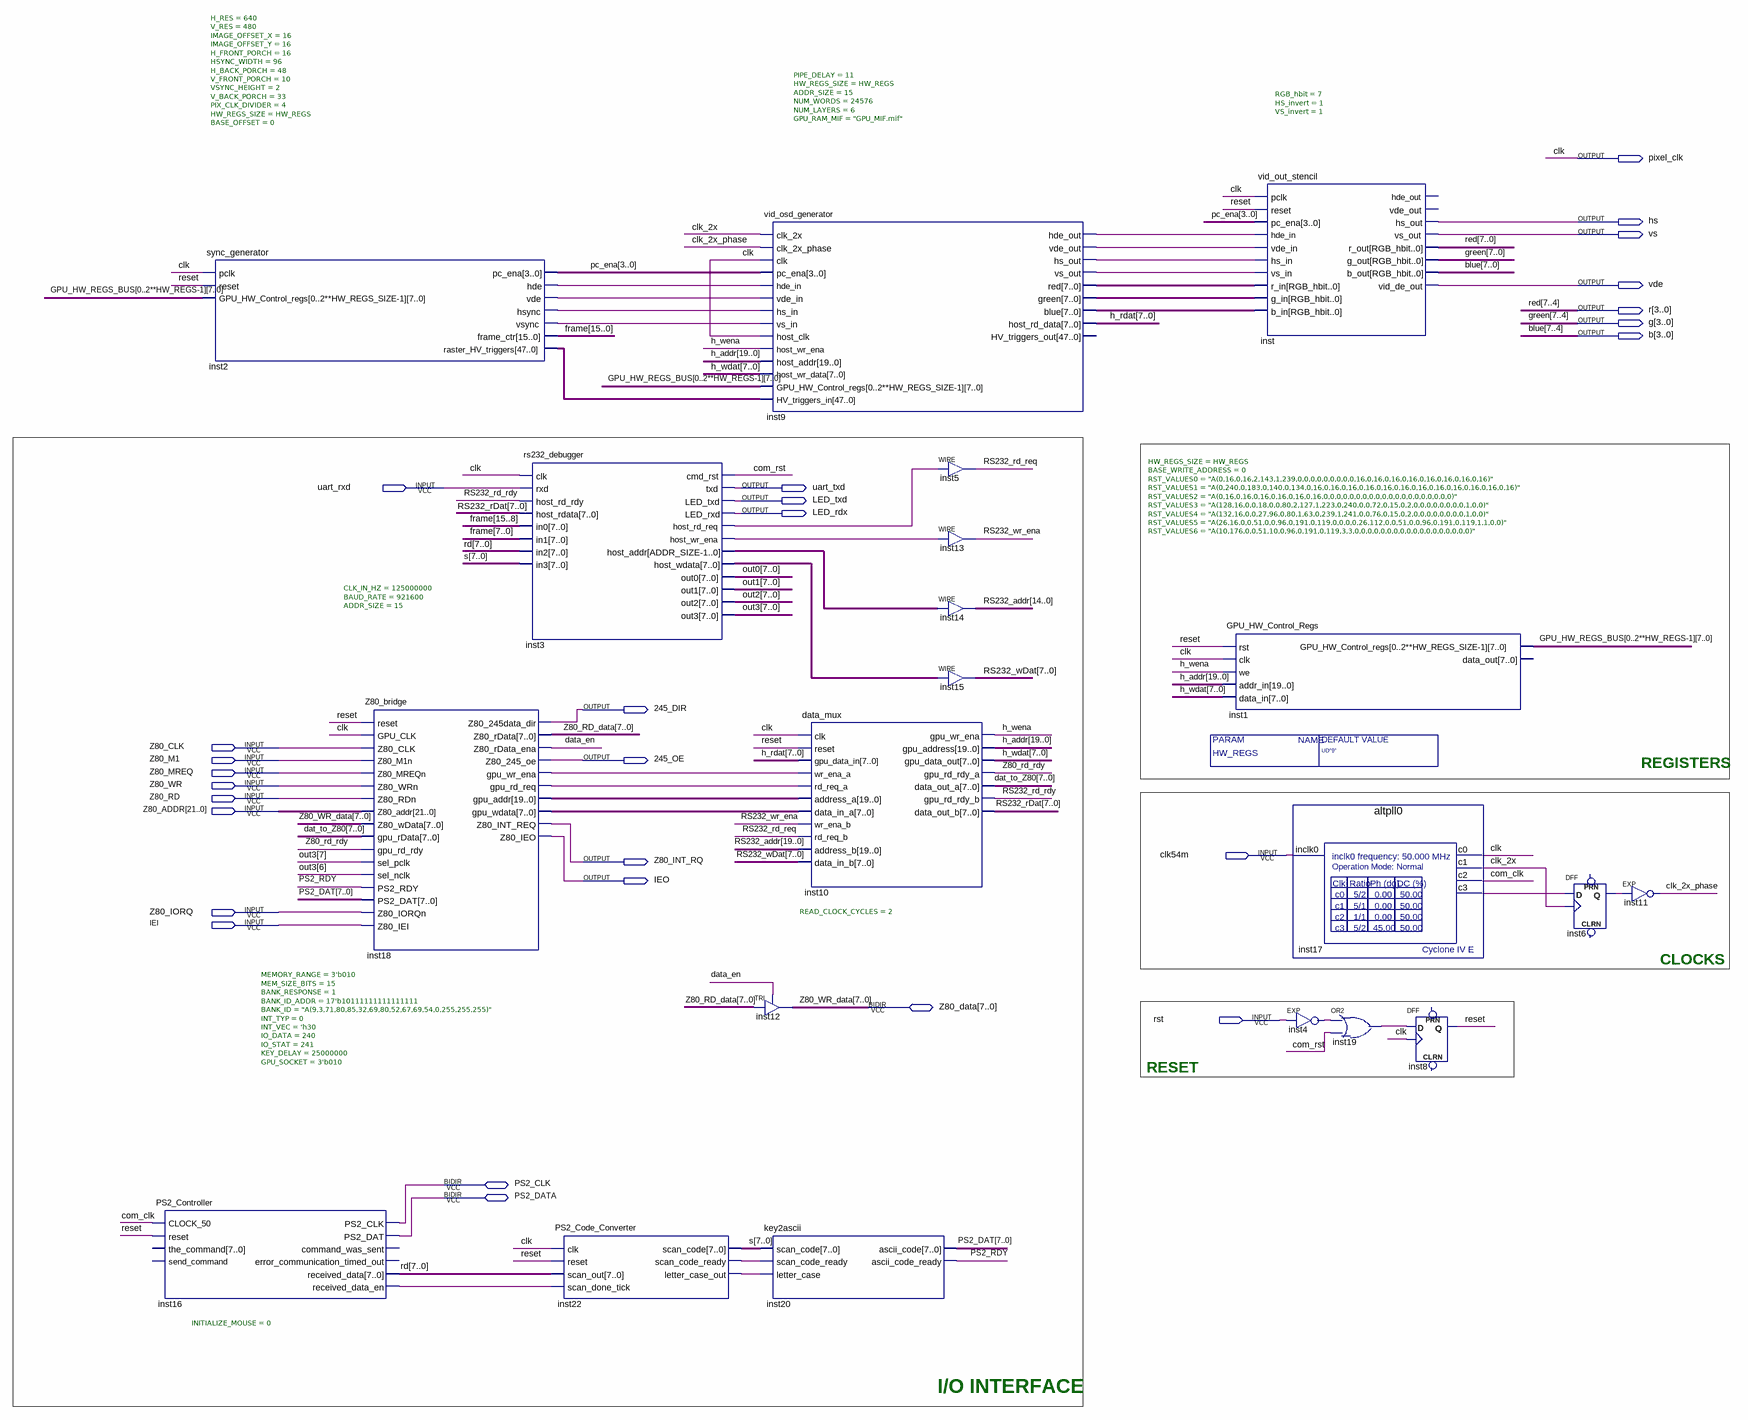
[diagram p0: schematic sheet]
// Quartus schematic GPU.bdf as structural Verilog: 21 symbols, 28 pins
module GPU #(parameter HW_REGS = "UD\"9\"") (
  input  uart_rxd,
  input  Z80_CLK,
  input  Z80_M1,
  input  Z80_MREQ,
  input  Z80_WR,
  input  Z80_RD,
  input  [21:0] Z80_ADDR,
  input  clk54m,
  input  Z80_IORQ,
  input  IEI,
  input  rst,
  inout  [7:0] Z80_data,
  inout  PS2_CLK,
  inout  PS2_DATA,
  output pixel_clk,
  output hs,
  output vs,
  output vde,
  output [3:0] r,
  output [3:0] g,
  output [3:0] b,
  output uart_txd,
  output LED_txd,
  output LED_rdx,
  output \245_DIR ,
  output \245_OE ,
  output Z80_INT_RQ,
  output IEO
);

  wire clk_2x, clk_2x_phase, com_clk, com_rst, data_en, h_wena, inst2_hde, inst2_hsync, inst2_vde,
       inst2_vsync, inst3_host_rd_req, inst3_host_wr_ena, inst4_out, inst6_q, inst9_hde_out, inst9_hs_out,
       inst9_vde_out, inst9_vs_out, inst16_received_data_en, inst17_c3, inst18_gpu_rd_req, inst18_gpu_wr_ena,
       inst19_out, inst22_letter_case_out, inst22_scan_code_ready, PS2_RDY, reset, RS232_rd_rdy,
       RS232_rd_req, RS232_wr_ena, Z80_rd_rdy;
  wire [3:0] blue, green, pc_ena, red;
  wire [7:0] dat_to_Z80, \GPU_HW_REGS_BUS[0..2**HW_REGS-1] , h_rdat, h_wdat, inst3_host_wdata, inst9_blue,
       inst9_green, inst9_red, inst18_gpu_wdata, out0, out1, out2, out3, PS2_DAT, rd, RS232_rDat, RS232_wDat,
       s, Z80_RD_data;
  wire [14:0] inst3_host_addr;
  wire [15:0] frame;
  wire [19:0] h_addr, inst18_gpu_addr, RS232_addr;
  wire [47:0] inst2_raster_hv_triggers;

  PS2_Controller #(.INITIALIZE_MOUSE(0)) inst16 (
    .CLOCK_50(com_clk), .reset(reset), .received_data(rd), .received_data_en(inst16_received_data_en),
    .PS2_CLK(PS2_CLK), .PS2_DAT(PS2_DATA));  // open: the_command, send_command, command_was_sent, error_communication_timed_out
  sync_generator #(.H_RES(640), .V_RES(480), .IMAGE_OFFSET_X(16), .IMAGE_OFFSET_Y(16), .H_FRONT_PORCH(16), .HSYNC_WIDTH(96), .H_BACK_PORCH(48), .V_FRONT_PORCH(10), .VSYNC_HEIGHT(2), .V_BACK_PORCH(33), .PIX_CLK_DIVIDER(4), .HW_REGS_SIZE(HW_REGS), .BASE_OFFSET(0)) inst2 (
    .pclk(pixel_clk), .reset(reset), .GPU_HW_Control_regs(\GPU_HW_REGS_BUS[0..2**HW_REGS-1] ),
    .pc_ena(pc_ena), .hde(inst2_hde), .vde(inst2_vde), .hsync(inst2_hsync), .vsync(inst2_vsync),
    .frame_ctr(frame), .raster_HV_triggers(inst2_raster_hv_triggers));
  Z80_bridge #(.MEMORY_RANGE(3'b010), .MEM_SIZE_BITS(15), .BANK_RESPONSE(1), .BANK_ID_ADDR(17'b10111111111111111), .BANK_ID("A(9,3,71,80,85,32,69,80,52,67,69,54,0,255,255,255)"), .INT_TYP(0), .INT_VEC('h30), .IO_DATA(240), .IO_STAT(241), .KEY_DELAY(25000000), .GPU_SOCKET(3'b010)) inst18 (
    .reset(reset), .GPU_CLK(pixel_clk), .Z80_CLK(Z80_CLK), .Z80_M1n(Z80_M1), .Z80_MREQn(Z80_MREQ),
    .Z80_WRn(Z80_WR), .Z80_RDn(Z80_RD), .Z80_addr(Z80_ADDR), .Z80_wData(Z80_data), .gpu_rData(dat_to_Z80),
    .gpu_rd_rdy(Z80_rd_rdy), .sel_pclk(out3[7]), .sel_nclk(out3[6]), .PS2_RDY(PS2_RDY), .PS2_DAT(PS2_DAT),
    .Z80_IORQn(Z80_IORQ), .Z80_IEI(IEI), .Z80_245data_dir(\245_DIR ), .Z80_rData(Z80_RD_data),
    .Z80_rData_ena(data_en), .Z80_245_oe(\245_OE ), .gpu_wr_ena(inst18_gpu_wr_ena),
    .gpu_rd_req(inst18_gpu_rd_req), .gpu_addr(inst18_gpu_addr), .gpu_wdata(inst18_gpu_wdata),
    .Z80_INT_REQ(Z80_INT_RQ), .Z80_IEO(IEO));
  rs232_debugger #(.CLK_IN_HZ(125000000), .BAUD_RATE(921600), .ADDR_SIZE(15)) inst3 (
    .clk(pixel_clk), .rxd(uart_rxd), .host_rd_rdy(RS232_rd_rdy), .host_rdata(RS232_rDat), .in0(frame[15:8]),
    .in1(frame[7:0]), .in2(rd), .in3(s), .cmd_rst(com_rst), .txd(uart_txd), .LED_txd(LED_txd),
    .LED_rxd(LED_rdx), .host_rd_req(inst3_host_rd_req), .host_wr_ena(inst3_host_wr_ena),
    .host_addr(inst3_host_addr), .host_wdata(inst3_host_wdata), .out0(out0), .out1(out1), .out2(out2),
    .out3(out3));
  PS2_Code_Converter inst22 (
    .clk(pixel_clk), .reset(reset), .scan_out(rd), .scan_done_tick(inst16_received_data_en), .scan_code(s),
    .scan_code_ready(inst22_scan_code_ready), .letter_case_out(inst22_letter_case_out));
  vid_osd_generator #(.PIPE_DELAY(11), .HW_REGS_SIZE(HW_REGS), .ADDR_SIZE(15), .NUM_WORDS(24576), .NUM_LAYERS(6), .GPU_RAM_MIF("GPU_MIF.mif")) inst9 (
    .clk_2x(clk_2x), .clk_2x_phase(clk_2x_phase), .clk(pixel_clk), .pc_ena(pc_ena), .hde_in(inst2_hde),
    .vde_in(inst2_vde), .hs_in(inst2_hsync), .vs_in(inst2_vsync), .host_clk(pixel_clk), .host_wr_ena(h_wena),
    .host_addr(h_addr), .host_wr_data(h_wdat), .GPU_HW_Control_regs(\GPU_HW_REGS_BUS[0..2**HW_REGS-1] ),
    .HV_triggers_in(inst2_raster_hv_triggers), .hde_out(inst9_hde_out), .vde_out(inst9_vde_out),
    .hs_out(inst9_hs_out), .vs_out(inst9_vs_out), .red(inst9_red), .green(inst9_green), .blue(inst9_blue),
    .host_rd_data(h_rdat));  // open: HV_triggers_out
  TRI inst12[7:0] (.IN(Z80_RD_data), .OE(data_en), .OUT(Z80_data));
  key2ascii inst20 (
    .scan_code(s), .scan_code_ready(inst22_scan_code_ready), .letter_case(inst22_letter_case_out),
    .ascii_code(PS2_DAT), .ascii_code_ready(PS2_RDY));
  data_mux #(.READ_CLOCK_CYCLES(2)) inst10 (
    .clk(pixel_clk), .reset(reset), .gpu_data_in(h_rdat), .wr_ena_a(inst18_gpu_wr_ena),
    .rd_req_a(inst18_gpu_rd_req), .address_a(inst18_gpu_addr), .data_in_a(inst18_gpu_wdata),
    .wr_ena_b(RS232_wr_ena), .rd_req_b(RS232_rd_req), .address_b(RS232_addr), .data_in_b(RS232_wDat),
    .gpu_wr_ena(h_wena), .gpu_address(h_addr), .gpu_data_out(h_wdat), .gpu_rd_rdy_a(Z80_rd_rdy),
    .data_out_a(dat_to_Z80), .gpu_rd_rdy_b(RS232_rd_rdy), .data_out_b(RS232_rDat));
  assign RS232_rd_req = inst3_host_rd_req;  // WIRE inst5
  assign RS232_wr_ena = inst3_host_wr_ena;  // WIRE inst13
  assign RS232_addr[14:0] = inst3_host_addr;  // WIRE inst14
  assign RS232_wDat = inst3_host_wdata;  // WIRE inst15
  GPU_HW_Control_Regs #(.HW_REGS_SIZE(HW_REGS), .BASE_WRITE_ADDRESS(0), .RST_VALUES0("A(0,16,0,16,2,143,1,239,0,0,0,0,0,0,0,0,0,16,0,16,0,16,0,16,0,16,0,16,0,16,0,16)"), .RST_VALUES1("A(0,240,0,183,0,140,0,134,0,16,0,16,0,16,0,16,0,16,0,16,0,16,0,16,0,16,0,16,0,16,0,16)"), .RST_VALUES2("A(0,16,0,16,0,16,0,16,0,16,0,16,0,0,0,0,0,0,0,0,0,0,0,0,0,0,0,0,0,0,0,0)"), .RST_VALUES3("A(128,16,0,0,18,0,0,80,2,127,1,223,0,240,0,0,72,0,15,0,2,0,0,0,0,0,0,0,0,1,0,0)"), .RST_VALUES4("A(132,16,0,0,27,96,0,80,1,63,0,239,1,241,0,0,76,0,15,0,2,0,0,0,0,0,0,0,0,1,0,0)"), .RST_VALUES5("A(26,16,0,0,51,0,0,96,0,191,0,119,0,0,0,0,26,112,0,0,51,0,0,96,0,191,0,119,1,1,0,0)"), .RST_VALUES6("A(10,176,0,0,51,10,0,96,0,191,0,119,3,3,0,0,0,0,0,0,0,0,0,0,0,0,0,0,0,0,0,0)")) inst1 (
    .rst(reset), .clk(pixel_clk), .we(h_wena), .addr_in(h_addr), .data_in(h_wdat),
    .GPU_HW_Control_regs(\GPU_HW_REGS_BUS[0..2**HW_REGS-1] ));  // open: data_out
  vid_out_stencil #(.RGB_hbit(7), .HS_invert(1), .VS_invert(1)) inst (
    .pclk(pixel_clk), .reset(reset), .pc_ena(pc_ena), .hde_in(inst9_hde_out), .vde_in(inst9_vde_out),
    .hs_in(inst9_hs_out), .vs_in(inst9_vs_out), .r_in(inst9_red), .g_in(inst9_green), .b_in(inst9_blue),
    .hs_out(hs), .vs_out(vs), .r_out({r, red}), .g_out({g, green}), .b_out({b, blue}), .vid_de_out(vde));  // open: hde_out, vde_out
  EXP inst4 (.IN(rst), .OUT(inst4_out));
  altpll0 inst17 (.inclk0(clk54m), .c0(pixel_clk), .c1(clk_2x), .c2(com_clk), .c3(inst17_c3));
  or inst19 (inst19_out, inst4_out, com_rst);
  DFF inst8 (.CLK(pixel_clk), .D(inst19_out), .Q(reset));  // open: CLRN, PRN
  DFF inst6 (.CLK(clk_2x), .D(inst17_c3), .Q(inst6_q));  // open: CLRN, PRN
  EXP inst11 (.IN(inst6_q), .OUT(clk_2x_phase));

  // Other names for the same wires on the sheet: blue[7:4] = b; clk = pixel_clk; green[7:4] = g; red[7:4] = r;
  //   Z80_WR_data[7:0] = Z80_data

  // Notes on the sheet:
  //   REGISTERS
  //   CLOCKS
  //   RESET
  //   I/O INTERFACE
endmodule
